# EAGLE board rev1 (EAGLE 8.2.2)
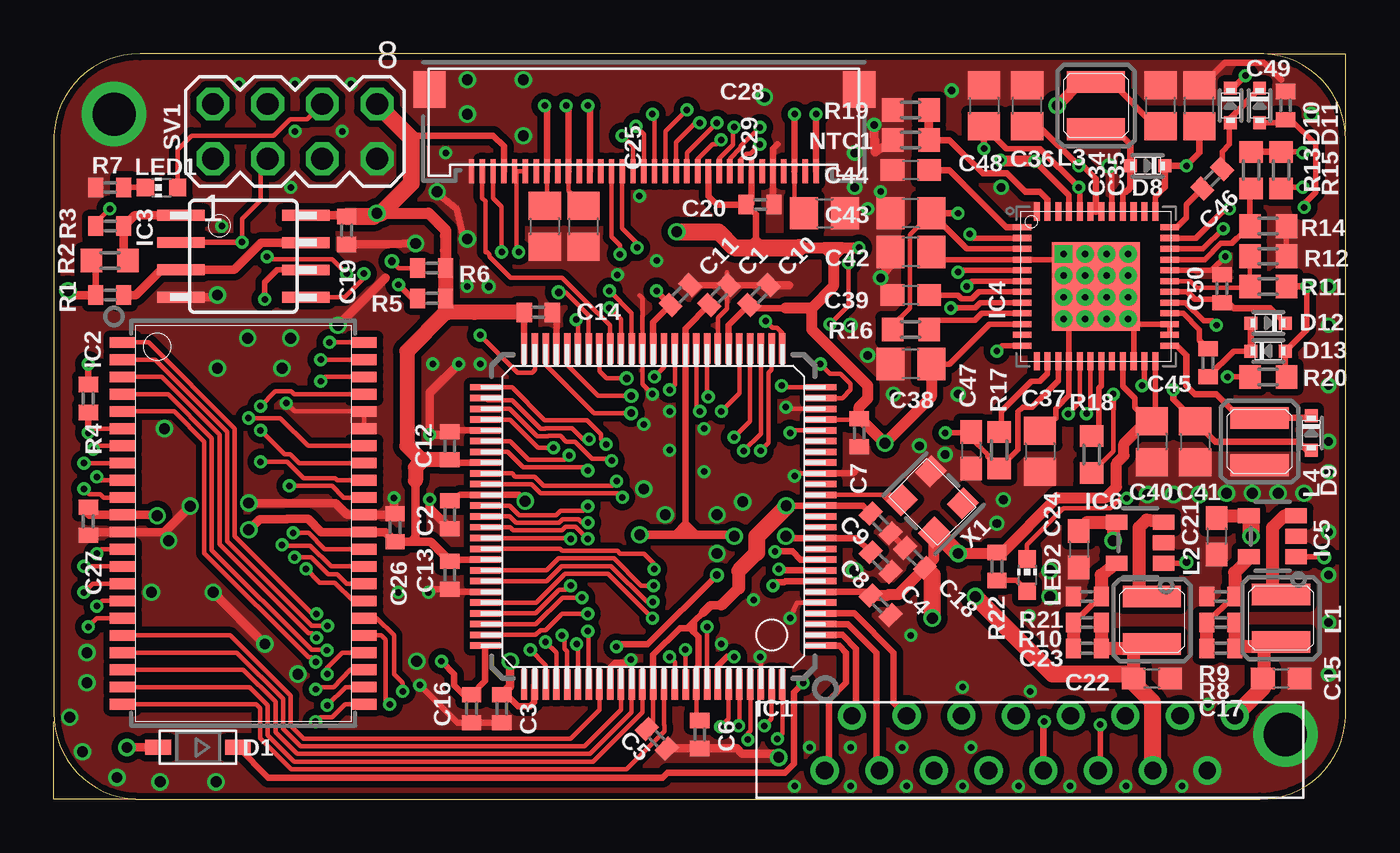
[diagram p3: board, top side]
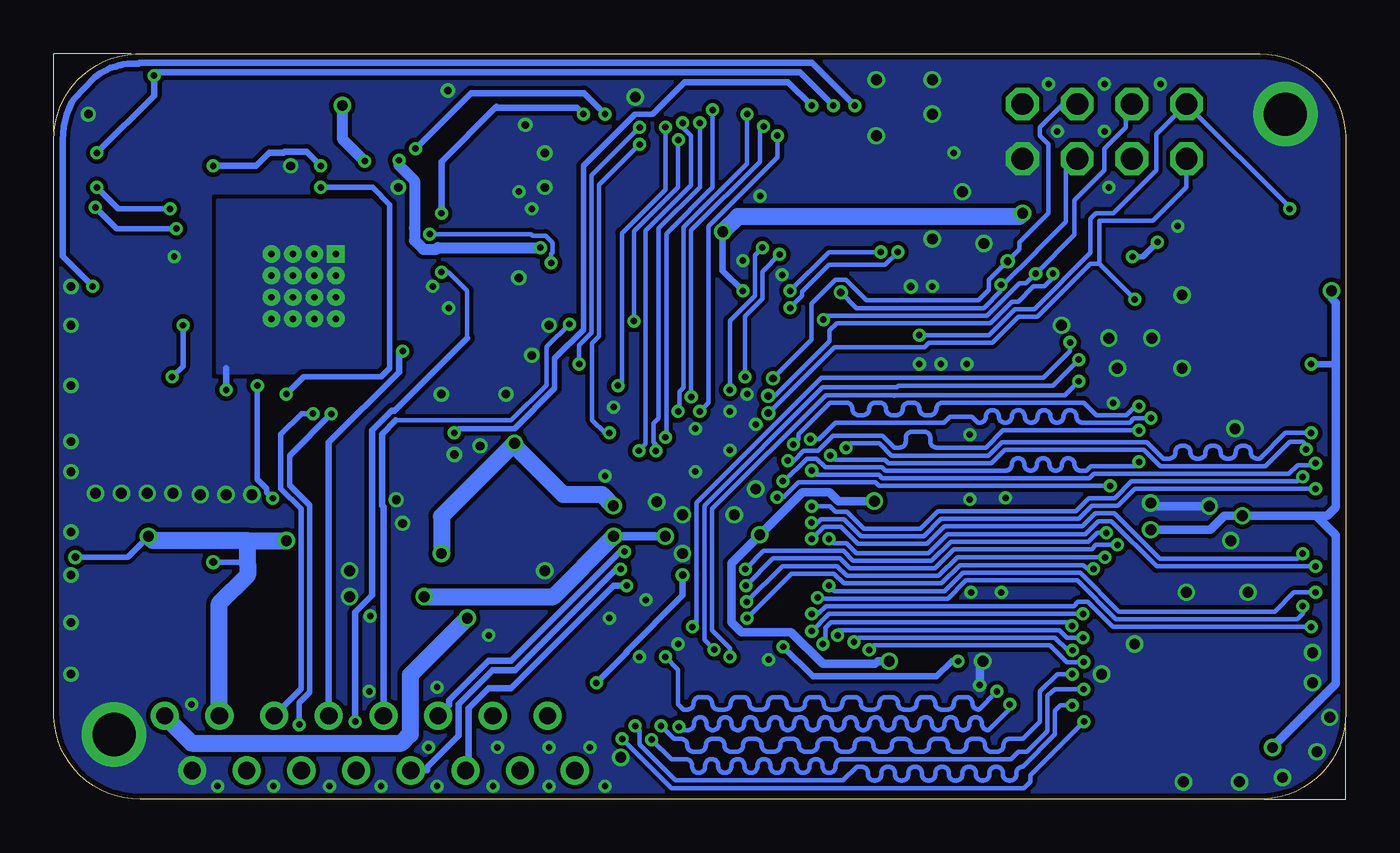
[diagram p4: board, bottom side, seen from below]

Size 60 x 34.6 mm. Coordinates in mm from the lower left corner, seen from the top.
Outline: 3.8,0 56,0 arc88 60,3.8 60,30.6 arc88 56.2,34.6 4,34.6 arc88 0,30.8 0,4 arc88 3.8,0
Outline: 3.8,0 0,0 0,3.6
Outline: 56.4,34.6 60,34.6 60,31
Copper layers (1*16): Top 0.035mm / dielectric 1.5mm / Bottom 0.035mm
Design rules "rules *": minimum track width 6mil, minimum drill 0.3mm, track to track 6mil, track to pad 6mil, pad to pad 6mil, via to via 6mil, smd to smd 0mil, copper to edge 10mil, drill to drill 10mil, minimum pad ring 10mil, minimum via ring 6mil, stop-mask expansion 2mil, vias tented up to drill 100mil, thermal gap 10mil

## Footprints (pad centres in the part's own frame; a part is rotated, then mirrored left to right if it is on the bottom)
C0402 = smd 0.7 x 0.9: 1 -0.65,0; 2 0.65,0
C0603 = smd 1.1 x 1: 1 -0.85,0; 2 0.85,0
C0805 = smd 1.3 x 1.5: 1 -0.95,0; 2 0.95,0
SOD-123 = smd 1.2 x 0.7: A 1.85,0; C -1.85,0
SOD523 = smd 0.6 x 0.6: A 0.8,0; C -0.8,0
VQ100 = smd 1.4 x 0.3: 1 -7.8,6; 2 -7.8,5.5; 3 -7.8,5; 4 -7.8,4.5; 5 -7.8,4; 6 -7.8,3.5; 7 -7.8,3; 8 -7.8,2.5; 9 -7.8,2; 10 -7.8,1.5; 11 -7.8,1; 12 -7.8,0.5; 13 -7.8,0; 14 -7.8,-0.5; 15 -7.8,-1; 16 -7.8,-1.5; 17 -7.8,-2; 18 -7.8,-2.5; 19 -7.8,-3; 20 -7.8,-3.5; 21 -7.8,-4; 22 -7.8,-4.5; 23 -7.8,-5; 24 -7.8,-5.5; 25 -7.8,-6; 51 7.8,-6; 52 7.8,-5.5; 53 7.8,-5; 54 7.8,-4.5; 55 7.8,-4; 56 7.8,-3.5; 57 7.8,-3; 58 7.8,-2.5; 59 7.8,-2; 60 7.8,-1.5; 61 7.8,-1; 62 7.8,-0.5; 63 7.8,0; 64 7.8,0.5; 65 7.8,1; 66 7.8,1.5; 67 7.8,2; 68 7.8,2.5; 69 7.8,3; 70 7.8,3.5; 71 7.8,4; 72 7.8,4.5; 73 7.8,5; 74 7.8,5.5; 75 7.8,6 | smd 0.3 x 1.4: 26 -6,-7.8; 27 -5.5,-7.8; 28 -5,-7.8; 29 -4.5,-7.8; 30 -4,-7.8; 31 -3.5,-7.8; 32 -3,-7.8; 33 -2.5,-7.8; 34 -2,-7.8; 35 -1.5,-7.8; 36 -1,-7.8; 37 -0.5,-7.8; 38 0,-7.8; 39 0.5,-7.8; 40 1,-7.8; 41 1.5,-7.8; 42 2,-7.8; 43 2.5,-7.8; 44 3,-7.8; 45 3.5,-7.8; 46 4,-7.8; 47 4.5,-7.8; 48 5,-7.8; 49 5.5,-7.8; 50 6,-7.8; 76 6,7.8; 77 5.5,7.8; 78 5,7.8; 79 4.5,7.8; 80 4,7.8; 81 3.5,7.8; 82 3,7.8; 83 2.5,7.8; 84 2,7.8; 85 1.5,7.8; 86 1,7.8; 87 0.5,7.8; 88 0,7.8; 89 -0.5,7.8; 90 -1,7.8; 91 -1.5,7.8; 92 -2,7.8; 93 -2.5,7.8; 94 -3,7.8; 95 -3.5,7.8; 96 -4,7.8; 97 -4.5,7.8; 98 -5,7.8; 99 -5.5,7.8; 100 -6,7.8
TSOP-2 = smd 0.5 x 1.2: 1 -8.4,-5.6; 2 -7.6,-5.6; 3 -6.8,-5.6; 4 -6,-5.6; 5 -5.2,-5.6; 6 -4.4,-5.6; 7 -3.6,-5.6; 8 -2.8,-5.6; 9 -2,-5.6; 10 -1.2,-5.6; 11 -0.4,-5.6; 12 0.4,-5.6; 13 1.2,-5.6; 14 2,-5.6; 15 2.8,-5.6; 16 3.6,-5.6; 17 4.4,-5.6; 18 5.2,-5.6; 19 6,-5.6; 20 6.8,-5.6; 21 7.6,-5.6; 22 8.4,-5.6; 23 8.4,5.6; 24 7.6,5.6; 25 6.8,5.6; 26 6,5.6; 27 5.2,5.6; 28 4.4,5.6; 29 3.6,5.6; 30 2.8,5.6; 31 2,5.6; 32 1.2,5.6; 33 0.4,5.6; 34 -0.4,5.6; 35 -1.2,5.6; 36 -2,5.6; 37 -2.8,5.6; 38 -3.6,5.6; 39 -4.4,5.6; 40 -5.2,5.6; 41 -6,5.6; 42 -6.8,5.6; 43 -7.6,5.6; 44 -8.4,5.6
SOP08 = smd 0.5 x 2.2: 1 -1.905,-2.9; 2 -0.645,-2.9; 3 0.625,-2.9; 4 1.895,-2.9; 5 1.905,2.9; 6 0.635,2.9; 7 -0.635,2.9; 8 -1.905,2.9
RGZ = smd 4.1 x 4.1: GN0 0,0 | drill 0.3 pad 0.4: GN1 -1.5,1.5 | drill 0.3 pad 0.406: GN2 -0.5,1.5; GN3 0.5,1.5; GN4 1.5,1.5; GN5 -1.5,0.5; GN6 -0.5,0.5; GN7 0.5,0.5; GN8 1.5,0.5; GN9 -1.5,-0.5; GN10 -0.5,-0.5; GN11 0.5,-0.5; GN12 1.5,-0.5; GN14 -0.5,-1.5; GN15 0.5,-1.5; GN16 1.5,-1.5 | drill 0.3 pad 0.406 square: GN13 -1.5,-1.5 | smd 0.85 x 0.28: P13 3.475,-2.75; P14 3.475,-2.25; P15 3.475,-1.75; P16 3.475,-1.25; P17 3.475,-0.75; P18 3.475,-0.25; P19 3.475,0.25; P20 3.475,0.75; P21 3.475,1.25; P22 3.475,1.75; P23 3.475,2.25; P24 3.475,2.75; P37 -3.475,2.75; P38 -3.475,2.25; P39 -3.475,1.75; P40 -3.475,1.25; P41 -3.475,0.75; P42 -3.475,0.25; P43 -3.475,-0.25; P44 -3.475,-0.75; P45 -3.475,-1.25; P46 -3.475,-1.75; P47 -3.475,-2.25; P48 -3.475,-2.75 | smd 0.28 x 0.85: P25 2.75,3.425; P26 2.25,3.425; P27 1.75,3.425; P28 1.25,3.425; P29 0.75,3.425; P30 0.25,3.425; P31 -0.25,3.425; P32 -0.75,3.425; P33 -1.25,3.425; P34 -1.75,3.425; P35 -2.25,3.425; P36 -2.75,3.425; P$1 -2.75,-3.425; P$2 -2.25,-3.425; P$3 -1.75,-3.425; P$4 -1.25,-3.425; P$5 -0.75,-3.425; P$6 -0.25,-3.425; P$7 0.25,-3.425; P$8 0.75,-3.425; P$9 1.25,-3.425; P$10 1.75,-3.425; P$11 2.25,-3.425; P$12 2.75,-3.425
TSOT25 = smd 0.7 x 1: 1 -0.95,-1.1; 2 0,-1.1; 3 0.95,-1.1; 4 0.95,1.1; 5 -0.95,1.1
XF2M-3315-1A = smd 0.25 x 1.1: 1 -8,3.05; 2 -7.5,3.05; 3 -7,3.05; 4 -6.5,3.05; 5 -6,3.05; 6 -5.5,3.05; 7 -5,3.05; 8 -4.5,3.05; 9 -4,3.05; 10 -3.5,3.05; 11 -3,3.05; 12 -2.5,3.05; 13 -2,3.05; 14 -1.5,3.05; 15 -1,3.05; 16 -0.5,3.05; 17 0,3.05; 18 0.5,3.05; 19 1,3.05; 20 1.5,3.05; 21 2,3.05; 22 2.5,3.05; 23 3,3.05; 24 3.5,3.05; 25 4,3.05; 26 4.5,3.05; 27 5,3.05; 28 5.5,3.05; 29 6,3.05; 30 6.5,3.05; 31 7,3.05; 32 7.5,3.05; 33 8,3.05 | smd 1.5 x 1.7: P$1 -10,-0.75; P$2 9.95,-0.75
TMM-5-L-16-2 = drill 0.8: 1 0,-1.27; 2 1.27,1.27; 3 2.54,-1.27; 4 3.81,1.27; 5 5.08,-1.27; 6 6.35,1.27; 7 7.62,-1.27; 8 8.89,1.27; 9 10.16,-1.27; 10 11.43,1.27; 11 12.7,-1.27; 12 13.97,1.27; 13 15.24,-1.27; 14 16.51,1.27; 15 17.78,-1.27; 16 19.05,1.27
3015 = smd 1 x 2.7: P$1 -1.1,0; P$2 1.1,0
CHIP-LED0603 = smd 0.8 x 0.8: A 0,-0.75; C 0,0.75
R0603 = smd 1 x 1.1: 1 -0.85,0; 2 0.85,0
R0402 = smd 0.7 x 0.9: 1 -0.65,0; 2 0.65,0
MA04-2 = drill 1.016 octagon: 1 -3.81,-1.27; 2 -3.81,1.27; 3 -1.27,-1.27; 4 -1.27,1.27; 5 1.27,-1.27; 6 1.27,1.27; 7 3.81,-1.27; 8 3.81,1.27
3225 = smd 1.1 x 1: 1 -0.95,1.05; 2 -0.95,-1.05; 3 0.95,-1.05; 4 0.95,1.05

## Placement (x,y rotation side)
C1  100nF  [C0402]  30.9,23.4 45 top
C2  100nF  [C0402]  18.4,13.2 270 top
C3  100nF  [C0402]  20.8,4.2 270 top
C4  100nF  [C0402]  38.4,11 315 top
C5  100nF  [C0402]  28,2.8 315 top
C6  100nF  [C0402]  30,3 270 top
C7  100nF  [C0402]  37.4,17 270 top
C8  100nF  [C0402]  38.4,9 315 top
C9  100nF  [C0402]  38.4,12.8 315 top
C10  100nF  [C0402]  32.75,23.4 45 top
C11  100nF  [C0402]  29.1,23.4 45 top
C12  100nF  [C0402]  18.4,16.4 90 top
C13  100nF  [C0402]  18.4,10.4 270 top
C14  100nF  [C0402]  22.5,22.6 0 top
C15  10uF  [C0603]  57,5.6 0 top
C16  [C0402]  19.4,4.2 270 top
C17  100pF  [C0402]  54.2,7 0 top
C18  100nF  [C0402]  40,11.2 135 top
C19  100nF  [C0402]  13.6,26.4 270 top
C20  100nF  [C0402]  32.8,27.6 0 top
C21  10uF  [C0603]  54,12.2 270 top
C22  10uF  [C0603]  51,5.6 0 top
C23  100pF  [C0402]  48,7 0 top
C24  10uF  [C0603]  47.6,11.6 270 top
C25  4u7F  [C0805]  24.6,26.6 270 top
C26  100nF  [C0402]  15.85,12.6 90 top
C27  100nF  [C0402]  1.6,12.9 270 top
C28  4u7F  [C0805]  35.8,27.2 0 top
C29  4u7F  [C0805]  22.8,26.6 270 top
C34  10uF  [C0805]  51.4,32.2 90 top
C35  4u7F  [C0805]  53.2,32.2 90 top
C36  4u7F  [C0805]  45.2,32.2 90 top
C37  4u7F  [C0805]  45.8,16.15 270 top
C38  10uF  [C0805]  39.8,20.2 180 top
C39  4u7F  [C0603]  39.8,23.4 180 top
C40  10uF  [C0805]  51,16.6 270 top
C41  4u7F  [C0805]  53,16.6 270 top
C42  4u7F  [C0805]  39.8,25.4 180 top
C43  4u7F  [C0805]  39.8,27.2 180 top
C44  4u7F  [C0603]  39.8,29.2 180 top
C45  10nF  [C0402]  53.6,20.25 270 top
C46  10nF  [C0402]  53.8,28.8 225 top
C47  4u7F  [C0603]  42.6,16.2 270 top
C48  4u7F  [C0805]  43.2,32.2 270 top
C49  100nF  [C0402]  57.2,32.2 270 top
C50  100nF  [C0402]  54.25,23.7 90 top
D1  [SOD-123]  6.7,2.4 180 top
D8  SKL13-DIO  [SOD523]  50.8,29.4 180 top
D9  SKL13-DIO  [SOD523]  58.4,17 270 top
D10  SKL13-DIO  [SOD523]  56,32.2 270 top
D11  SKL13-DIO  [SOD523]  54.65,32.2 270 top
D12  SKL13-DIO  [SOD523]  56.4,22.1 180 top
D13  SKL13-DIO  [SOD523]  56.4,20.8 0 top
IC1  ICE40-HX1K-VQ100  [VQ100]  27.84,13.12 180 top
IC2  IS61WV256BXX  [TSOP-2]  8.8,12.8 270 top
IC3  25LPWP016D  [SOP08]  8.8,25.2 270 top
IC4  TPS65185  [RGZ]  48.4,23.8 270 top
IC5  PAM2304AABADJ  [TSOT25]  56.6,12.2 90 top
IC6  PAM2304AABADJ  [TSOT25]  50.45,11.9 90 top
J1  XF2M-3315-1A  [XF2M-3315-1A]  27.4,32.2 180 top
J2  TMM-5-L-16-2  [TMM-5-L-16-2]  35.8,2.6 0 top
L1  1uH  [3015]  57,8.4 270 top
L2  1uH  [3015]  51,8.3 270 top
L3  2u2H  [3015]  48.4,32.2 270 top
L4  4u7H  [3015]  56,16.6 270 top
LED1  [CHIP-LED0603]  5,28.4 90 top
LED2  [CHIP-LED0603]  45.2,10.4 0 top
NTC1  10k  [R0603]  39.8,30.6 0 top
R1  10k  [R0402]  2.6,23.4 180 top
R2  10k  [R0603]  2.6,25 0 top
R3  22  [R0402]  2.6,26.6 180 top
R4  10k  [R0402]  1.6,18.6 270 top
R5  10k  [R0402]  17.55,23.25 180 top
R6  2k2  [R0402]  17.55,24.65 180 top
R7  22  [R0402]  2.6,28.4 0 top
R8  540k  [R0402]  54.2,8.2 180 top
R9  120k  [R0402]  54.2,9.4 0 top
R10  540k  [R0402]  48,8.2 180 top
R11  1M  [R0603]  56.4,23.8 0 top
R12  52k3  [R0603]  56.4,25.2 180 top
R13  1M  [R0603]  55.6,29.2 270 top
R14  47k5  [R0603]  56.4,26.6 0 top
R15  [R0603]  57,29.2 90 top
R16  [R0603]  39.8,21.8 180 top
R17  [R0603]  43.9,16.2 270 top
R18  [R0603]  48.2,16 270 top
R19  43k  [R0603]  39.8,32 0 top
R20  [R0603]  56.4,19.6 0 top
R21  120k  [R0402]  48,9.4 0 top
R22  22  [R0402]  43.8,10.8 270 top
SV1  [MA04-2]  11.2,31 0 top
X1  DSC61XX  [3225]  40.8,13.8 225 top

## Tracks (layer width: path | path; a pad name or v marks a point on that pad's centre or on a via)
1V2  (via drill 0.5, 0.5 pad 0.45)
  Top 0.3: C2.1 18.87,14.12 IC1.61 21.6,14.12 v21.89,13.83 | IC1.35 | IC1.35 29.34,21.84 C1.1 | 29.34,12.82 IC1.35 | 29.34,12.82 29.34,12.32 29.39,12.27 | v34,12.2 34.08,12.12 IC1.11 37.28,12.12 C4.1 | 28.8,12.27 28.8,12.28 29.34,12.82 | 30,12.27 29.89,12.27 29.34,12.82
  Top 0.305: IC1.77 22.3,5.28 22.3,4.49 22.12,4.32 21.56,4.32 21.03,4.85 C3.1
  Top 0.4: v21.2,6.4 21.2,5.25 C3.1 | v27.21,12.27 28.8,12.27 29.39,12.27 30,12.27 31.53,12.27 v31.6,12.2
  Top 0.6: R10.1 C23.2 50.11,7 50.15,7.04 | C22.1 50.15,7.04 | 50.15,7.04 50.15,7.35 50.2,7.4 50.9,7.4 L2.P$2
  Top 0.8: C22.1 49.73,5.8 | J2.13 51.04,4.5 49.73,5.8 | v42.8,9.4 46.4,5.8 49.73,5.8
  Bottom 0.4: v21.2,6.4 21.73,6.4 21.86,6.28 24.29,6.28 25.76,7.75 28.07,7.75 28.53,8.21 28.53,10.95 v27.21,12.27 25.23,14.25 23.97,14.25 23.55,13.83 v21.89,13.83 | v34,12.2 v31.6,12.2
  Bottom 0.8: v42.8,9.4 36.8,9.4 v34,12.2
2V5  (via drill 0.3, 0.3 pad 0.45, 0.35)
  Top 0.3: C16.1 19.04,4.85 18.6,5.29 18.6,5.8 v18,6.4 | v34.8,5.4 34.37,4.97 34.37,1.65 33.95,1.23 28.5,1.23 28.26,0.99 9.96,0.99 D1.C | v30.8,10.4 27.58,7.18 26.24,7.18 v26.13,7.07
  Top 0.305: IC1.75 20.04,5.49 C16.1
  Bottom 0.3: v18,6.4 18.3,6.4 19,5.7 24.75,5.7 v26.13,7.07 | v34.8,5.4 33.41,6.79 33.41,6.85 30.8,9.46 v30.8,10.4
3V3  (via drill 0.3, 0.5, 0.5 pad 0.45)
  Top 0.2: IC1.88 27.84,3.56 C5.1 | IC1.92 29.84,3.81 C6.1 | IC1.22 37.27,17.62 C7.1 | C40.1 51.1,17.55 51.15,17.5 | R22.1 43.95,11.45 44,11.4 | R6.1 18.2,24.38
  Top 0.25: IC4.P$10 43.45,22.05 41.6,20.2 C38.1 | IC4.P45 47.15,28.03 v45.56,29.62 | 51.15,17.5 IC4.P24 | IC4.P21 49.65,19.17 50.2,18.62 50.2,18.2 50.85,17.55 C40.1
  Top 0.3: IC1.67 18.47,11.12 C13.1 | IC1.58 18.53,15.62 C12.1 | 29.74,7.75 29.94,7.55 29.94,6.2 29.84,6.1 IC1.92 | 29.74,7.75 29.74,8.25 | IC1.88 27.84,6.7 29.07,7.93 29.41,7.93 | IC1.50 C14.1 | IC1.38 | IC1.31 | IC1.38 27.84,22.14 C11.1 28,23.58 v28,23.6 | IC1.31 31.34,21.99 C10.1 32.43,22.8 34,22.8 | 29.41,7.93 29.56,7.93 29.74,7.75 | 29.74,8.25 29.73,8.25 29.41,7.93 | 33.03,25.6 32.6,26.03 | 32.2,25.6 32.2,25.62 32.6,26.03 | C9.1 37.58,13.62 IC1.14 v34.02,13.62 34,13.6 | IC1.6 37.78,9.62 C8.1 | 30.14,8.65 29.74,8.25 | R1.2 1.95,24.8 R2.1 | R4.1 v1.6,20.2 | C34.1 51.15,31.25 49.2,33.2 48.5,33.2 L3.P$1 | J1.7 32.4,27.65 C20.1 | C20.1 30.8,27.6 30.4,28 J1.11 | 32.6,26.03 32.6,27.14 C20.1 | J1.30 20.9,30.3 20.4,30.8 16.72,30.8 16.6,30.68
  Top 0.4: v9.05,12.5 9.55,13 10.84,13 10.85,13.01 11.81,13.01 12.42,12.4 IC2.33 15.4,12.4 C26.1 16.6,11.95 | C27.1 1.65,13.2 IC2.11 4.75,13.2 v4.8,13.15 | 16.6,11.95 17.5,11.95 C13.1 | 16.6,11.95 16.8,12.15 16.8,14.8 | v3.4,2.4 D1.A | IC3.8 13.54,27.11 C19.1 14.05,27.05 | R1.2 0.86,23.4 v0.66,23.6 | 31,9 30.49,9 30.14,8.65
  Top 0.5: C11.1 28.64,22.96 | 36.59,25.6 35.81,25.6 | 35.81,25.6 34.62,25.6 33.03,25.6 32.2,25.6 | 36.59,25.6 v37.4,25.6 | C10.1 32.46,22.94 | 36.2,25.2 36.59,25.6 | 36.2,25.2 36.2,25.21 35.81,25.6 | L3.P$1 47.7,33.3 v46.6,32.2 | v45.56,29.62 44.01,29.62 v43.97,29.66 | C38.1 40.75,18.67 v38.6,16.52 37.47,17.65 C7.1 37.4,18.2 37.8,18.6 37.8,19.2 35.2,21.8 35.2,22.8 | C8.1 38.72,9.46 38.76,9.51 39.23,9.51 C18.1 40.87,11.15 X1.4 | C40.1 50.65,17.2 50.4,17.2 49.7,16.5 49.7,15.94 49.35,15.59 49.35,14.48 48.87,14 46.6,14 44,11.4 v42,11.4 | 31.8,9.8 31,9 | 35.2,22.8 36.2,23.8 36.2,25.2 | 35.2,22.8 34,22.8 | v15,27.2 17.4,27.2 18.2,26.4 18.2,26.14 18.2,26.13 18.2,25.47 18.2,25.46 R6.1
  Top 0.6: R8.1 C17.2 54.95,7.1 56.2,7.1 | C15.1 56.2,5.65 56.2,7.1 | 56.2,7.1 56.2,7.4 | 31.8,10.6 31.8,9.8
  Top 0.7: C12.1 17.15,15.75 | 17.15,15.75 16.8,15.4 16.8,14.8 | 17.15,15.75 17.05,15.75 16.4,16.4 16.4,20.8 18.2,22.6 18.2,22.7 | 18.2,22.7 R5.1 R6.1 | C14.1 19.54,22.6 19.53,22.59 18.3,22.59 18.2,22.7 | 32.64,11.44 31.8,10.6
  Top 0.8: 56.15,7.35 56.2,7.4 56.9,7.4 L1.P$2 | C15.1 56.15,5.17 J2.16 | v40.8,8.4 40.8,10.4 C18.1 | X1.4 41.01,12.39 v42,11.4 | v34.02,13.62 34.02,13.57 32.64,12.19 32.64,11.44 | C19.1 14.85,27.05 v15,27.2 15.2,27.2 16.6,28.6 16.6,30.68 SV1.8 | v28.94,26.34 30.86,26.34 31.6,25.6 34.62,25.6
  Bottom 0.3: v1.6,20.2 v1.59,20.19 0.45,20.19 | v28.94,26.34 28.94,24.54 v28,23.6
  Bottom 0.4: v9.05,12.5 6.3,12.5 5.64,13.15 v4.8,13.15 1.35,13.15 | 1.35,13.15 0.45,12.25 0.45,5.35 v3.4,2.4 | 1.35,13.15 0.84,13.15 0.45,13.55 0.45,20.19 0.45,23.05 0.66,23.26 v0.66,23.6
  Bottom 0.5: v46.6,32.2 46.6,30.66 v45.56,29.62 | v43.97,29.66 43.97,29.44 43.24,28.71 43.24,26.52 43.25,26.52 43.25,25.94 42.83,25.52 42.25,25.52 42.17,25.6 v37.4,25.6 | 38.6,16.4 v38.6,16.52
  Bottom 0.8: J2.16 54.85,3.85 53.6,2.6 43.85,2.6 43.45,3 43.45,5.75 v40.8,8.4 | v42,11.4 42,13.12 v38.6,16.52 | v15,27.2 15.15,27.05 28.23,27.05 v28.94,26.34 | 38.6,16.4 36.34,14.14 34.55,14.14 v34.02,13.62
!CE  (via drill 0.3 pad 0.45)
  Top 0.2: IC2.6 1.8,17.2 v1.6,17 | IC1.54 21.18,17.62 22.49,16.31 v23.2,16.31
  Top 0.3: v1.6,17 R4.2
  Bottom 0.2: v1.6,17 2.8,17 3.99,15.81 4.12,15.81 arc90 4.41,16.1 4.41,16.11 arc-90 4.7,16.4 4.82,16.4 arc-90 5.11,16.11 5.11,16.1 arc90 5.4,15.81 5.52,15.81 arc90 5.81,16.1 5.81,16.11 arc-90 6.1,16.4 6.22,16.4 arc-90 6.51,16.11 6.51,16.1 arc90 6.8,15.81 6.92,15.81 arc90 7.21,16.1 7.21,16.11 arc-90 7.5,16.4 7.62,16.4 arc-90 7.91,16.11 7.91,16.1 arc90 8.2,15.81 8.47,15.81 9.22,16.57 15.97,16.57 16.59,15.95 21.09,15.95 21.65,16.52 23,16.52 v23.2,16.31
!OE  (via drill 0.3 pad 0.45)
  Top 0.2: IC1.51 21.28,19.12 22.8,17.6 24.77,17.6 25.42,16.95 25.42,16.7 v25.65,16.47 | IC2.41 11.17,18.8 11.03,18.94 10.29,18.94 v9.6,18.25
  Bottom 0.2: v9.6,18.25 9.76,18.25 10.18,17.83 11.57,17.83 12.15,18.41 18.72,18.41 arc-90 19.02,18.12 arc90 19.3,17.83 19.5,17.83 arc90 19.79,18.12 arc-90 20.08,18.41 20.28,18.41 arc-90 20.57,18.12 arc90 20.86,17.83 21.06,17.83 arc90 21.35,18.12 arc-90 21.64,18.41 21.84,18.41 arc-90 22.13,18.12 arc90 22.42,17.83 22.62,17.83 arc90 22.91,18.12 arc-90 23.2,18.41 23.96,18.41 25.42,16.95 25.42,16.7 v25.65,16.47
!WE  (via drill 0.3 pad 0.45)
  Top 0.2: IC2.17 2,8.4 v1.6,8 | v24.8,8.6 23.6,8.6 22.85,7.85 22.61,7.85 22.38,7.62 IC1.74
  Bottom 0.2: v24.8,8.6 24.5,8.6 24.15,8.95 12.63,8.95 12.43,9.15 11.97,9.15 10.81,8 v1.6,8
A00  (via drill 0.3 pad 0.45)
  Top 0.2: IC2.1 4.4,21.2 8.4,17.2 8.4,12.2 12,8.6 v12.2,8.6 | IC1.82 24.84,7.76 v24.8,7.8
  Bottom 0.2: v12.2,8.6 24,8.6 v24.8,7.8
A01  (via drill 0.3 pad 0.45)
  Top 0.2: IC2.2 4.7,20.4 8.05,17.05 8.05,11.97 11.97,8.04 v12.72,8.04 | IC1.81 24.34,7.14 v24.29,7.2
  Bottom 0.2: v12.72,8.04 12.87,8.2 23.9,8.2 24.15,7.95 24.15,7.33 v24.29,7.2
A02  (via drill 0.3 pad 0.45)
  Top 0.2: IC2.3 5,19.6 7.7,16.91 7.7,11.82 11.82,7.69 12,7.69 v12.2,7.49 | IC1.80 23.84,6.86 23.73,6.97 23.73,7.47 v23.6,7.6
  Bottom 0.2: v12.2,7.49 12.95,7.49 13.3,7.85 23.55,7.85 23.6,7.8 v23.6,7.6
A03  (via drill 0.3 pad 0.45)
  Top 0.2: IC2.4 5.3,18.8 7.34,16.76 7.34,11.56 11.97,6.94 12.66,6.94 v12.69,6.91 | IC1.79 23.34,6.79 v22.84,7.29
  Bottom 0.2: v12.69,6.91 12.91,6.91 13.49,7.5 22.64,7.5 v22.84,7.29
A04  (via drill 0.3 pad 0.45)
  Top 0.2: IC2.5 5.59,18 6.99,16.6 6.99,11.42 11.82,6.58 11.95,6.58 v12.16,6.37 | IC1.78 22.84,6.22 v22.13,6.93
  Bottom 0.2: v12.16,6.37 12.45,6.37 12.46,6.36 12.96,6.36 13.74,7.14 21.92,7.14 v22.13,6.93
A05
  Top 0.2: IC2.18 8.2,7.6 11,4.8 11,3.4 11.6,2.8 24,2.8 25.34,4.14 IC1.83
A06
  Top 0.2: IC2.19 8.5,6.8 10.65,4.65 10.65,3.25 11.45,2.45 24.65,2.45 26.34,4.14 IC1.85
A07
  Top 0.2: IC2.20 8.8,6 10.29,4.51 10.29,3.11 11.31,2.1 24.89,2.1 26.84,4.04 IC1.86
A08
  Top 0.2: IC2.21 9.11,5.2 9.94,4.36 9.94,2.96 11.16,1.74 25.04,1.74 27.34,4.04 IC1.87
A09
  Top 0.2: IC2.22 9.41,4.4 9.59,4.22 9.59,2.82 11.02,1.39 26.59,1.39 28.36,3.16 28.36,3.44 28.34,3.45 IC1.89
A10  (via drill 0.3 pad 0.45)
  Top 0.2: IC2.23 13.54,4.4 12.93,3.79 12.39,3.79 v12.15,3.6 | IC1.100 33.84,3.04 v33.6,2.8
  Bottom 0.2: v12.15,3.6 14.65,1.1 14.65,0.8 14.94,0.51 16.69,0.51 | 16.69,0.51 | 16.69,0.51 31.31,0.51 v33.6,2.8
A11  (via drill 0.3 pad 0.45)
  Top 0.2: IC2.24 13.55,5.2 v12.7,4.35 | IC1.99 33.34,3.74 v33,3.4
  Bottom 0.2: v12.7,4.35 13.25,4.35 13.49,4.11 13.49,3.01 15,1.5 arc-90 15.29,1.21 15.29,1.15 arc90 15.58,0.86 15.63,0.86 arc90 15.92,1.15 15.92,1.21 arc-90 16.21,1.5 16.26,1.5 arc-90 16.55,1.21 16.55,1.15 arc90 16.84,0.86 16.88,0.86 arc90 17.17,1.15 17.17,1.21 arc-90 17.46,1.5 17.51,1.5 arc-90 17.8,1.21 17.8,1.15 arc90 18.09,0.86 18.14,0.86 arc90 18.43,1.15 18.43,1.21 arc-90 18.72,1.5 18.77,1.5 arc-90 19.05,1.21 19.05,1.15 arc90 19.35,0.86 19.39,0.86 arc90 19.68,1.15 19.68,1.21 arc-90 19.97,1.5 20.02,1.5 arc-90 20.31,1.21 20.31,1.15 arc90 20.6,0.86 20.65,0.86 arc90 20.94,1.15 20.94,1.21 arc-90 21.23,1.5 21.27,1.5 arc-90 21.56,1.21 21.56,1.15 arc90 21.85,0.86 21.9,0.86 arc90 22.19,1.15 22.19,1.21 arc-90 22.48,1.5 22.71,1.5 23.34,0.87 31.12,0.87 32.79,2.54 32.79,3.19 v33,3.4
A12  (via drill 0.3 pad 0.45)
  Top 0.2: IC2.25 13.76,6 13,5.2 12.44,5.2 12.29,5.2 v12.16,5.1 | v32.23,2.77 32.23,3.05 32.35,3.17 32.35,5.11 32.34,5.12 IC1.97
  Bottom 0.2: v12.16,5.1 13.5,5.1 13.85,4.8 13.85,3.15 14.8,2.2 15.19,2.2 15.54,1.85 23.4,1.85 arc-90 23.69,1.56 23.69,1.51 arc90 23.98,1.22 24.01,1.22 arc90 24.3,1.51 24.3,1.56 arc-90 24.59,1.85 24.61,1.85 arc-90 24.9,1.56 24.9,1.51 arc90 25.19,1.22 25.22,1.22 arc90 25.51,1.51 25.51,1.56 arc-90 25.8,1.85 25.82,1.85 arc-90 26.11,1.56 26.11,1.51 arc90 26.4,1.22 26.43,1.22 arc90 26.72,1.51 26.72,1.56 arc-90 27.01,1.85 27.03,1.85 arc-90 27.32,1.56 27.32,1.51 arc90 27.61,1.22 27.64,1.22 arc90 27.93,1.51 27.93,1.56 arc-90 28.22,1.85 28.25,1.85 arc-90 28.54,1.56 28.54,1.51 arc90 28.83,1.22 28.85,1.22 arc90 29.14,1.51 29.14,1.56 arc-90 29.43,1.85 29.46,1.85 arc-90 29.75,1.56 29.75,1.51 arc90 30.04,1.22 30.06,1.22 arc90 30.35,1.51 30.35,1.56 arc-90 30.64,1.85 31.32,1.85 v32.23,2.77
A13  (via drill 0.3 pad 0.45)
  Top 0.2: IC2.26 13.4,6.8 12.67,6.07 v12.7,5.8 | IC1.96 31.84,3.44 v31.8,3.4
  Bottom 0.2: v31.8,3.4 31.2,2.8 30.87,2.8 arc90 30.58,2.51 30.58,2.49 arc-90 30.29,2.2 30.01,2.2 arc-90 29.72,2.49 29.72,2.51 arc90 29.43,2.8 29.14,2.8 arc90 28.85,2.51 28.85,2.49 arc-90 28.56,2.2 28.28,2.2 arc-90 27.99,2.49 27.99,2.51 arc90 27.7,2.8 27.42,2.8 arc90 27.12,2.51 27.12,2.49 arc-90 26.84,2.2 26.55,2.2 arc-90 26.26,2.49 26.26,2.51 arc90 25.97,2.8 25.69,2.8 arc90 25.4,2.51 25.4,2.49 arc-90 25.11,2.2 24.82,2.2 arc-90 24.53,2.49 24.53,2.51 arc90 24.24,2.8 23.96,2.8 arc90 23.67,2.51 23.67,2.49 arc-90 23.38,2.2 23.09,2.2 arc-90 22.8,2.49 22.8,2.51 arc90 22.51,2.8 22.23,2.8 arc90 21.94,2.51 21.94,2.49 arc-90 21.65,2.2 21.37,2.2 arc-90 21.08,2.49 21.08,2.51 arc90 20.79,2.8 20.5,2.8 arc90 20.21,2.51 20.21,2.49 arc-90 19.92,2.2 19.64,2.2 arc-90 19.35,2.49 19.35,2.51 arc90 19.06,2.8 18.77,2.8 arc90 18.48,2.51 18.48,2.49 arc-90 18.19,2.2 17.91,2.2 arc-90 17.62,2.49 17.62,2.51 arc90 17.33,2.8 17.05,2.8 arc90 16.75,2.51 16.75,2.49 arc-90 16.46,2.2 16.18,2.2 arc-90 15.89,2.49 15.89,2.51 arc90 15.6,2.8 15,2.8 14.2,3.6 14.2,5 13.4,5.8 12.67,5.8 v12.7,5.8
A14  (via drill 0.3 pad 0.45)
  Top 0.2: 15,7.6 IC2.27 15.2,7.6 15.4,7.4 15.4,4.6 v15.6,4.4 | IC1.95 31.34,3.73 v30.97,3.35
  Bottom 0.2: v15.6,4.4 15.6,4.2 16.6,3.2 arc90 16.89,3.49 16.89,3.51 arc-90 17.18,3.8 17.18,3.8 arc-90 17.47,3.51 17.47,3.49 arc90 17.76,3.2 | 29.4,3.2 arc90 29.69,3.49 29.69,3.51 arc-90 29.98,3.8 29.98,3.8 arc-90 30.27,3.51 30.27,3.49 arc90 30.56,3.2 30.82,3.2 v30.97,3.35 | 29.4,3.2 | 29.4,3.2 arc-90 29.11,3.49 29.11,3.51 arc90 28.82,3.8 28.82,3.8 arc90 28.52,3.51 28.52,3.49 arc-90 28.23,3.2 28.23,3.2 arc-90 27.94,3.49 27.94,3.51 arc90 27.65,3.8 | 27.65,3.8 | 27.65,3.8 arc90 27.36,3.51 27.36,3.49 arc-90 27.07,3.2 27.07,3.2 arc-90 26.78,3.49 26.78,3.51 arc90 26.49,3.8 26.49,3.8 arc90 26.2,3.51 26.2,3.49 arc-90 25.91,3.2 25.91,3.2 arc-90 25.62,3.49 25.62,3.51 arc90 25.32,3.8 | 25.32,3.8 | 25.32,3.8 arc90 25.03,3.51 25.03,3.49 arc-90 24.74,3.2 24.74,3.2 arc-90 24.45,3.49 24.45,3.51 arc90 24.16,3.8 24.16,3.8 arc90 23.87,3.51 23.87,3.49 arc-90 23.58,3.2 | 23.58,3.2 | 23.58,3.2 arc-90 23.29,3.49 23.29,3.51 arc90 23,3.8 23,3.8 arc90 22.71,3.51 22.71,3.49 arc-90 22.42,3.2 22.42,3.2 arc-90 22.13,3.49 22.13,3.51 arc90 21.84,3.8 | 21.84,3.8 | 21.84,3.8 arc90 21.54,3.51 21.54,3.49 arc-90 21.25,3.2 21.25,3.2 arc-90 20.96,3.49 20.96,3.51 arc90 20.67,3.8 20.67,3.8 arc90 20.38,3.51 20.38,3.49 arc-90 20.09,3.2 20.09,3.2 arc-90 19.8,3.49 19.8,3.51 arc90 19.51,3.8 | 19.51,3.8 | 19.51,3.8 arc90 19.22,3.51 19.22,3.49 arc-90 18.93,3.2 18.93,3.2 arc-90 18.64,3.49 18.64,3.51 arc90 18.34,3.8 18.34,3.8 arc90 18.05,3.51 18.05,3.49 arc-90 17.76,3.2 | 17.76,3.2
A15  (via drill 0.3 pad 0.45)
  Top 0.2: IC2.42 12.6,19.6 v12.4,19.4 | v28.6,6.6 28.84,6.36 IC1.90
  Bottom 0.2: v12.4,19.4 13.04,18.76 20.93,18.76 20.96,18.72 21,18.76 24.15,18.76 29.44,13.47 29.44,7.83 28.6,6.99 v28.6,6.6
A16  (via drill 0.3 pad 0.45)
  Top 0.2: IC2.43 v12.4,20.4 | v29.33,6.94 IC1.91
  Bottom 0.2: v12.4,20.4 13.6,19.2 20.77,19.2 20.85,19.11 21.14,19.11 24.29,19.11 29.79,13.62 29.79,7.4 v29.33,6.94
A17  (via drill 0.3 pad 0.45)
  Top 0.2: IC2.44 v12.8,21.2 | v30.34,8 IC1.93
  Bottom 0.2: v12.8,21.2 12.8,20.8 14.05,19.55 20.62,19.55 | 20.62,19.55 | 20.62,19.55 24.35,19.55 30.14,13.76 30.14,8.2 v30.34,8
A18  (via drill 0.3 pad 0.45)
  Top 0.2: IC2.28 15,8.4 15.8,7.6 15.8,5.8 16.2,5.4 v16.2,5
  Top 0.3: v31.6,6.6 31.25,6.6 30.84,6.18 IC1.94
  Bottom 0.2: v16.2,5 17.05,4.16 arc90 17.34,4.45 17.34,4.45 arc-90 17.63,4.74 17.91,4.74 arc-90 18.2,4.45 18.2,4.45 arc90 18.49,4.16 18.77,4.16 arc90 19.06,4.45 19.06,4.45 arc-90 19.35,4.74 19.64,4.74 arc-90 19.93,4.45 19.93,4.45 arc90 20.22,4.16 20.5,4.16 arc90 20.79,4.45 20.79,4.45 arc-90 21.08,4.74 21.36,4.74 arc-90 21.65,4.45 21.65,4.45 arc90 21.94,4.16 22.23,4.16 arc90 22.52,4.45 22.52,4.45 arc-90 22.81,4.74 23.09,4.74 arc-90 23.38,4.45 23.38,4.45 arc90 23.67,4.16 23.95,4.16 arc90 24.24,4.45 24.24,4.45 arc-90 24.53,4.74 24.82,4.74 arc-90 25.11,4.45 25.11,4.45 arc90 25.4,4.16 25.68,4.16 arc90 25.97,4.45 25.97,4.45 arc-90 26.26,4.74 26.54,4.74 arc-90 26.83,4.45 26.83,4.45 arc90 27.12,4.16 27.41,4.16 arc90 27.7,4.45 27.7,4.45 arc-90 27.99,4.74 28.27,4.74 arc-90 28.56,4.45 28.56,4.45 arc90 28.85,4.16 29.13,4.16 arc90 29.42,4.45 29.42,4.45 arc-90 29.71,4.74 30,4.74 arc-90 30.29,4.45 30.29,4.45 arc90 30.58,4.16 30.75,4.16 31,4.4 31,6 v31.6,6.6
CLK_SRC
  Top 0.2: IC1.15 38.4,14.12 38.48,14.12 | 38.48,14.12 38.8,13.8 38.8,14.12 | 38.48,14.12 38.8,14.12 | 38.8,14.12 39.14,14.12 X1.3
CONF_DONE  (via drill 0.35)
  Top 0.2: LED1.A 5.75,30.15 6.4,30.8 10.21,30.8 10.97,31.55 11.76,31.55 SV1.6 | v26.6,19.53 25.67,19.53 25.34,19.86 IC1.43 | R6.2 16.02,24.65 v15.7,24.97
  Bottom 0.2: SV1.6 12.6,32.4 13,32.4 14.2,31.2 14.2,30.8 13.8,30.4 13.8,27.2 15.14,25.86 15.14,25.53 v15.7,24.97 16.56,24.11 16.56,23.64 17.05,23.15 22.25,23.15 23.21,24.11 23.69,24.11 24.81,22.99 24.81,21.32 v26.6,19.53
CONF_RESET  (via drill 0.3, 0.35)
  Top 0.2: v23.45,23.53 23.77,23.53 24.84,22.46 IC1.44
  Top 0.3: R5.2 16.64,23.25 v16.01,23.88
  Bottom 0.2: 16.01,23.78 v16.01,23.88 | 16.01,23.78 16.01,23.59 16.8,22.8 22.72,22.8 v23.45,23.53 | 16.01,23.78 14.35,25.44 14.35,25.45 13,26.8 13,29.2 SV1.5
CONF_SCK  (via drill 0.3, 0.35)
  Top 0.2: IC1.48 22.84,20.16 24.73,18.27 | 24.73,18.27 24.84,18.16 | v26.81,17.91 25.09,17.91 24.73,18.27
  Top 0.25: v9.8,23.2 9.8,24 10.37,24.57 IC3.6
  Bottom 0.2: 11.45,24.85 11.45,26.85 8.95,26.85 7.4,28.4 SV1.1 | 11.45,24.85 v9.8,23.2 | 11.45,24.85 11.87,24.85 14.32,22.4 15.21,22.4 16.42,21.19 19.37,21.19 19.57,20.99 23.74,20.99 v26.81,17.91
CONF_SDI  (via drill 0.3, 0.35)
  Top 0.2: IC1.46 23.84,20.16 25.28,18.72 v26.82,18.72 | v9.91,25.18 10.02,25.07 12.93,25.07 v13.6,24.4 | 5.92,25.86 IC3.2 | v8.74,25.86 8.74,26.94 9.6,27.8 9.6,29.4 SV1.3
  Top 0.25: 5.92,25.86 v8.74,25.86
  Bottom 0.2: v13.6,24.4 13.6,24.2 14,23.8 14.5,23.8 15.2,23.1 15.5,23.1 16.51,22.09 23.64,22.09 23.96,21.77 23.96,21.26 26.5,18.72 v26.82,18.72
  Bottom 0.25: v9.91,25.18 9.42,25.18 v8.74,25.86
CONF_SDO  (via drill 0.3)
  Top 0.2: v14.4,24.4 14.4,24.2 13.49,23.3 IC3.5 | IC1.45 24.34,22.18 v24.26,22.26
  Bottom 0.2: SV1.4 10.2,32 10.2,31.2 11.2,30.2 11.2,29.2 12.6,27.8 12.6,26.2 v14.4,24.4 14.85,23.95 15.15,23.95 16.65,22.45 24.07,22.45 v24.26,22.26
CONF_SS  (via drill 0.3)
  Top 0.2: IC1.49 22.34,19.94 22.2,19.8 21.54,19.8 v19.8,21.54 | R3.2 1.95,26.75 v2.6,27.4
  Bottom 0.2: v19.8,21.54 16.56,21.54 15.36,22.75 14.47,22.75 11.85,25.37 11.85,26.95 11.6,27.2 10.8,27.2 8.8,29.2 8.8,30.86 SV1.2 2.6,27.48 v2.6,27.4
CTRL_PIN  (via drill 0.3)
  Top 0.25: IC4.P$12 44.05,21.05 v43.8,20.8
  Bottom 0.3: J2.10 47.23,16.56 43.97,19.82 43.97,20.63 v43.8,20.8
D00  (via drill 0.3, 0.3 pad 0.45)
  Top 0.2: IC1.56 21.18,16.62 22.05,15.75 23.73,15.75 v23.94,15.96 | IC2.7 2,16.4 v1.83,16.23
  Bottom 0.2: v23.94,15.96 23.91,15.96 23.7,15.76 21.39,15.76 21.24,15.6 16.44,15.6 15.83,16.21 9.37,16.21 8.61,15.46 3.74,15.46 2.6,16.6 2,16.6 1.83,16.43 v1.83,16.23
D01  (via drill 0.3 pad 0.45)
  Top 0.2: IC2.8 v1.4,15.6 | v24.8,15.26 24.66,15.4 21.8,15.4 21.08,16.12 IC1.57
  Bottom 0.2: v1.4,15.6 1.49,15.51 2.23,15.51 2.63,15.11 11.7,15.11 11.91,14.89 21.53,14.89 21.69,15.05 21.98,15.05 | 21.98,15.05 | v24.8,15.26 24.6,15.05 21.98,15.05
D02  (via drill 0.3 pad 0.45)
  Top 0.2: IC2.9 2.15,14.8 v2,14.96 | IC1.62 21.18,13.62 21.62,13.18 23.32,13.18 23.53,13.39 24.6,13.39 v24.8,13.59
  Bottom 0.2: v2,14.96 2.04,14.96 2.25,14.75 9.95,14.75 10.73,13.97 11.93,13.97 12.54,13.36 18.94,13.36 19.74,12.55 22.37,12.55 23.15,13.34 23.7,13.34 23.95,13.59 v24.8,13.59
D03  (via drill 0.3 pad 0.45)
  Top 0.2: v24.81,12.84 24.53,12.84 24.38,12.99 23.62,12.99 23.46,12.82 21.47,12.82 21.18,13.12 IC1.63 | 1.6,14.2 v1.4,14.4 1.65,14.15 2.15,14.15 2.31,14 IC2.10
  Bottom 0.2: v1.4,14.4 9.8,14.4 10.59,13.61 11.79,13.61 12.39,13.01 18.79,13.01 19.6,12.2 22.52,12.2 23.3,12.99 24.38,12.99 24.53,12.84 v24.81,12.84
D04  (via drill 0.3 pad 0.45)
  Top 0.2: IC2.13 2.2,11.6 v2,11.4 | v24.8,12.08 24.79,12.08 24.23,12.63 23.77,12.63 23.61,12.47 21.33,12.47 21.18,12.62 IC1.64
  Bottom 0.2: v2,11.4 2.25,11.15 8.63,11.15 10.74,13.26 11.63,13.26 12.24,12.66 18.64,12.66 19.45,11.85 22.66,11.85 23.45,12.63 24.23,12.63 24.79,12.08 v24.8,12.08
D05  (via drill 0.3 pad 0.45)
  Top 0.2: IC2.14 v1.4,10.8 | IC1.65 23.96,12.12 v24,12.08
  Bottom 0.2: v1.4,10.8 8.78,10.8 10.89,12.91 11.49,12.91 12.09,12.3 18.5,12.3 19.38,11.42 22.73,11.42 23.19,11.88 23.8,11.88 v24,12.08
D06  (via drill 0.3 pad 0.45)
  Top 0.2: IC2.15 1.8,10 v1.4,9.6 | v24,9.91 23.8,9.71 23.47,9.71 22.39,8.62 IC1.72
  Bottom 0.2: v1.4,9.6 2.4,9.6 3.29,8.71 10.52,8.71 12.33,10.51 17.78,10.51 18.63,9.66 23.75,9.66 v24,9.91
D07  (via drill 0.3 pad 0.45)
  Top 0.2: IC1.73 22.38,8.12 23.62,9.36 v24.53,9.36 | IC2.16 2.25,9.2 v2,8.96
  Bottom 0.2: v2,8.96 2,8.6 2.25,8.35 10.67,8.35 12.47,10.15 17.63,10.15 18.48,9.3 24.47,9.3 v24.53,9.36
D08  (via drill 0.3 pad 0.45)
  Top 0.2: IC1.71 22.39,9.12 23.73,10.47 25.73,10.47 v27.8,8.4 | IC2.29 13.9,9.2 13.05,10.05 12.35,10.05 v11.72,10.68
  Bottom 0.2: v11.72,10.68 12,10.68 12.18,10.86 17.92,10.86 18.77,10.01 23.31,10.01 23.77,10.47 25.73,10.47 v27.8,8.4
D09  (via drill 0.3 pad 0.45)
  Top 0.2: v11.18,11.22 11.47,11.22 11.49,11.24 11.95,11.24 12.74,10.45 13.15,10.45 13.6,10 IC2.30 | IC1.69 22.89,10.12 23.59,10.82 25.88,10.82 27.54,9.16 v27.83,9.16
  Bottom 0.2: v11.18,11.22 11.47,11.22 11.49,11.24 18.04,11.24 18.92,10.36 23.17,10.36 23.62,10.82 26.16,10.82 v27.83,9.16
D10  (via drill 0.3 pad 0.45)
  Top 0.2: IC2.31 12.88,10.8 11.91,11.77 10.63,11.77 v10.6,11.8 | v27.86,9.91 27.28,9.91 26.02,11.17 23.44,11.17 22.89,10.62 IC1.68
  Bottom 0.2: v10.6,11.8 11.6,11.8 11.8,11.6 18.2,11.6 19.09,10.71 23.02,10.71 23.48,11.17 26.6,11.17 v27.86,9.91
D11  (via drill 0.3 pad 0.45)
  Top 0.2: IC2.32 12.58,11.6 11.83,12.36 v11.12,12.36 | v27.88,10.68 27.88,10.92 27.4,11.4 26.3,11.4 26.17,11.52 23.6,11.52 23.5,11.62 IC1.66
  Bottom 0.2: v27.88,10.68 27.03,11.52 23.33,11.52 22.88,11.07 19.23,11.07 18.35,11.95 11.95,11.95 11.54,12.36 v11.12,12.36
D12  (via drill 0.3 pad 0.45)
  Top 0.2: IC2.35 13.46,14 12.92,14.54 v10.94,14.54 | v26.4,14 26.21,14.2 22.6,14.2 22.18,14.62 IC1.60
  Bottom 0.2: v26.4,14 26.12,14 25.42,14.7 21.83,14.7 21.67,14.54 v10.94,14.54
D13  (via drill 0.3 pad 0.45)
  Top 0.2: IC2.36 13.16,14.8 13.07,14.89 11.6,14.89 10.83,15.66 v9.6,15.66 | v26.14,14.76 25.94,14.56 22.74,14.56 22.33,14.97 21.43,14.97 21.28,15.12 IC1.59
  Bottom 0.2: v9.6,15.66 9.8,15.46 11.84,15.46 12.05,15.25 12.3,15.25 arc90 12.59,15.54 arc-90 12.88,15.83 12.88,15.83 arc-90 13.18,15.54 arc90 13.47,15.25 13.47,15.25 arc90 13.76,15.54 arc-90 14.05,15.83 14.05,15.83 arc-90 14.34,15.54 arc90 14.63,15.25 14.64,15.25 arc90 14.93,15.54 arc-90 15.22,15.83 15.22,15.83 arc-90 15.51,15.54 arc90 15.8,15.25 21.38,15.25 21.54,15.4 22.12,15.4 | 22.12,15.4 | v26.14,14.76 26.08,14.76 25.03,15.81 24.57,15.81 24.16,15.4 22.12,15.4
D14  (via drill 0.3 pad 0.45)
  Top 0.2: IC2.37 11.39,15.6 10.98,16.01 10.71,16.01 v9.6,17.12 | IC1.53 21.18,18.12 22.45,16.85 22.95,16.85 22.97,16.87 23.53,16.87 23.8,16.6 24.2,16.6 24.99,15.81 25.81,15.81 v25.91,15.71
  Bottom 0.2: v9.6,17.12 15.92,17.12 16.72,16.32 19,16.32 arc90 19.29,16.61 19.29,16.77 arc-90 19.58,17.05 20.14,17.05 arc-90 20.43,16.77 20.43,16.61 arc90 20.72,16.32 20.96,16.32 21.51,16.87 23.81,16.87 24.52,16.16 25.18,16.16 25.63,15.71 v25.91,15.71
D15  (via drill 0.3 pad 0.45)
  Top 0.2: IC2.38 11.8,16.4 10.51,17.69 v9.04,17.69 | IC1.52 20.14,18.52 21.27,18.52 22.59,17.2 22.81,17.2 22.82,17.22 24.08,17.22 24.58,16.72 v24.87,16.72
  Bottom 0.2: v9.04,17.69 9.06,17.68 9.83,17.68 10.03,17.47 12.21,17.47 arc90 12.51,17.77 arc-90 12.8,18.05 12.82,18.05 arc-90 13.11,17.77 arc90 13.4,17.47 13.42,17.47 arc90 13.71,17.77 arc-90 14,18.05 14.02,18.05 arc-90 14.31,17.77 arc90 14.6,17.47 14.62,17.47 arc90 14.91,17.77 arc-90 15.2,18.05 15.22,18.05 arc-90 15.51,17.77 arc90 15.8,17.47 15.82,17.47 arc90 16.11,17.77 arc-90 16.4,18.05 16.42,18.05 arc-90 16.71,17.77 arc90 17,17.47 17.09,17.47 17.37,17.75 18.38,17.75 18.66,17.47 23.7,17.47 24.46,16.72 v24.87,16.72
GND  (via drill 0.3, 0.3 pad 0.45, 0.35, 0.4, 0.5, 0.5 pad 0.45, 2)
  Top 0.2: IC1.98 32.84,6.56 v32.8,6.6 | IC1.5 34.52,9.12 v34.2,8.4 | IC1.17 34.52,15.12 v34.4,15 | v27.8,18.8 27.34,19.26 IC1.39 27.34,23.26 27.2,23.4 | C5.2 | IC2.39 IC2.40 11.18,18 v10.8,18.38 | IC1.32 30.84,22.35 31.26,22.77 31.26,24.46 | IC1.23 34.08,18.12 v34,18.2
  Top 0.25: IC4.P$6 42.65,24.05 v42.4,23.8 | IC4.P$8 43.04,23.05 42.81,22.82 41.67,22.82 v41.66,22.8 | IC4.P32 53.77,24.55 v54.41,25.19
  Top 0.254: R12.1 R14.2 | IC4.P41 49.15,28.95 v49,29.4
  Top 0.3: v26.8,6.47 26.65,6.32 26.07,6.32 25.84,6.1 IC1.84 | IC1.47 23.34,22.41 C14.2 | C11.2 C1.2 C10.2 | C9.2 C18.2 | v19.2,26 19.1,25.9 19.38,25.9 19.09,25.79 18.7,27.41 17.71,28.2 | C35.2 53.35,33.15 54.4,34.2 56.19,34.2 56.21,34.19 57,33.4 | IC1.17 37.12,15.12 37.2,15.2 | C20.2 33.4,27.85 J1.5 33.4,30.2 33.6,30.4
  Top 0.305: IC1.70 18.53,9.62 C13.2 17.55,9.75 v17.4,9.6 | IC1.55 18.67,17.12 C12.2 | C3.2 C16.2 18.74,3.55 v17,5.29
  Top 0.4: v6.34,13.6 5.14,12.4 IC2.12 1.65,12.4 C27.2 | v9.05,13.74 13.08,13.74 13.62,13.2 IC2.34 15.8,13.2 C26.2 15.8,13.3 v15.8,13.99 | C2.2 17.45,13.49 v17.45,13.92 | C12.2 18.27,16.92 v17.45,16.92 17.45,18.86 v18.8,20.2 | v33.66,1.94 33.49,2.11 31.96,2.11 31.72,2.35 C6.2 C5.2 | IC3.4 7.5,23.3 v7.6,23.4 | C10.2 34.14,23.86 | v9.8,7.2 v7.4,9.6 | C19.2 15.55,25.75 v16.8,25.8 | 15.4,24.2 v13.2,22
  Top 0.406: 39.05,25.05 v38.4,24.2 38.45,24.15 | v38.1,31.3 38.15,30.05 NTC1.1
  Bottom 0.25: v54.41,25.19 v54.4,25.2
  Bottom 0.305: 17,5.2 v17,5.29
  Bottom 0.4: v6.34,13.6 8.91,13.6 v9.05,13.74 | v17,5.29 17,6.25 v16.86,6.4
  other vias: 30.2,17.2 44,28.4 59.2,5.8 44.1,13.9 16,9.6 20.2,23.8 38.4,28.2 11,21.4 2.8,31.8 17.8,28.2 19.8,20.2 10.6,20 7.6,20 9,21.4 28.4,13.2 27.4,14.4 32,13.8 30.8,11.4 30.8,13.2 28,25 57.2,3 58.4,31.8 41.7,32.9 37.8,27.4 37,22 30.2,15.2 39,18.8 42,18.8 59.2,8.2 59.2,10.4 59.2,12.4 59.2,15.2 59.2,16.6 59.2,19.2 59.2,22 59.2,23.8 37.8,20.6 37.2,28.4 37.2,30 5.34,12 5.14,17.2 1.54,6.8 1.54,5.4 0.74,3.8 1.34,2.2 2.94,1 4.94,0.8 7.54,0.8 11.34,5.8 4.54,9.6 28.6,18 28.6,16.2 27.4,17.4 19.2,23.8 19.2,31.8 37.2,10.6 40.2,16.4 41.4,16 43.8,12.8 7.8,26.6 13.4,31 11.2,31 11.2,33.2 8.6,33.2 13.8,33.2 17.6,20.2 11,28.4 53.2,14.14 56.86,14.2 55.66,14.2 54.46,14.2 58.06,14.2 46.26,9.4 46.26,10.6 52,14.14 50.8,14.14 32.5,9.25 31,7.2 35.1,2.4 37,2.4 39.4,2.4 42.6,2.4 42.2,5.2 39.8,7.6 44.8,0.6 42.2,0.6 39.6,0.6 37,0.6 34.4,0.6 47.2,0.6 49.8,0.6 52.4,0.6 53.6,4.4 45.35,5 45.3,8.5 33,32.6 21.8,30.8 19.2,33.4 21.8,33.4 27.2,28 18.2,30 26.18,24.34
  pour Bottom (isolate 0.2, rank 6, no thermals): -1.2,36.4 61,36.4 61,-1.2 -1.2,-1.2
  pour Top (isolate 0.3, no thermals): -0.6,35 60.2,35.2 60.2,-0.8 -0.6,-1
INT_LDO1
  Top 0.25: IC4.P$7 42.97,23.55 42.64,23.22 42.16,23.22 41.98,23.4 C39.1
INT_PIN  (via drill 0.3)
  Top 0.2: v36.05,22.05 36.91,22.91 v36.91,24.89
  Top 0.25: IC4.P$2 42.72,26.05 v42.54,26.23
  Bottom 0.2: v42.54,26.23 37.84,26.23 37.77,26.16 37.17,26.16 36.84,25.83 36.84,25.37 36.91,25.31 v36.91,24.89 | 37.11,20.27 37.11,20.2 | 37.11,20.2 37.11,19.22 38.76,17.58 44.12,17.58 | 37.11,20.2 37.11,21 v36.05,22.05
  Bottom 0.3: J2.8 44.69,13.56 44.76,13.63 44.76,16.95 44.12,17.58
LCD_CKV
  Top 0.2: J1.32 19.9,27.9 20.04,27.76 20.04,25.47 | IC1.42 25.84,21.99 25.25,22.58 25.22,22.58 23.6,24.2 21.21,24.2 20.25,25.17 20.25,25.27 20.04,25.47 | 20.04,25.47 20.04,25.4
LCD_CL  (via drill 0.3)
  Top 0.2: IC1.21 34.32,17.12 v34.2,17 | v32.8,30.4 32.35,29.95 32.17,29.95 31.9,29.68 J1.8
  Bottom 0.2: v34.2,17 34.4,17 35,17.6 35,21.17 34.67,21.5 34.67,28.52 v32.8,30.4
LCD_D0  (via drill 0.3)
  Top 0.2: J1.13 29.4,30 v30.8,31.4 | IC1.27 33.34,19.94 33.2,19.8 33.2,16.55 v32.83,16.17
  Bottom 0.2: v30.8,31.4 30.8,31.2 30.4,30.8 30.4,28.5 32.51,26.39 32.51,16.49 v32.83,16.17
LCD_D1  (via drill 0.3)
  Top 0.2: IC1.28 32.84,16.97 v32.03,16.16 | v30,31.4 29.8,31.4 28.9,30.5 J1.14
  Bottom 0.2: v32.03,16.16 32.03,16.45 32.16,16.57 32.16,17.45 31.91,17.69 31.91,26.49 30,28.4 v30,31.4
LCD_D2  (via drill 0.3)
  Top 0.2: IC1.29 32.34,17.54 v31.6,16.8 | v29.4,32 28.4,31 J1.15
  Bottom 0.2: v29.4,32 29.4,28.4 31.55,26.24 31.55,16.84 v31.6,16.8
LCD_D3  (via drill 0.3)
  Top 0.2: IC1.30 31.84,18.84 v31,18 | v27.8,31.8 27.9,31.7 J1.16
  Bottom 0.2: 30.75,24.57 30.75,24.47 | 30.75,24.57 30.75,26.55 27.8,29.5 v27.8,31.8 | 30.75,24.57 30.75,19.11 30.95,18.91 30.95,18.05 v31,18
LCD_D4  (via drill 0.3)
  Top 0.2: J1.17 27.4,30.87 v27.04,31.23 | IC1.33 30.34,18.73 v30.39,18.68
  Bottom 0.2: v27.04,31.23 27.2,31.07 27.2,29.6 30.39,26.41 v30.39,18.68
LCD_D5  (via drill 0.3)
  Top 0.2: J1.18 26.9,30.3 v26.4,30.8 | IC1.34 29.84,18.16 v30,18
  Bottom 0.2: v26.4,30.8 26.4,29.8 29.6,26.6 29.6,18.4 v30,18
LCD_D6  (via drill 0.3)
  Top 0.2: IC1.36 28.84,19.24 v28.6,19 | v27.09,25.6 27.09,25.8 26.4,26.5 J1.19
  Bottom 0.2: 27,25.5 v27.09,25.6 27.45,25.25 27.45,23.37 28.6,22.21 v28.6,19
LCD_D7  (via drill 0.3)
  Top 0.2: IC1.37 28.34,20.05 v27.89,19.6 | v26.29,25.29 26.29,25.71 25.9,26.1 J1.20
  Bottom 0.2: v27.89,19.6 27.89,22.42 27.09,23.22 27.09,24.49 v26.29,25.29
LCD_GMODE  (via drill 0.3)
  Top 0.2: J1.28 J1.29 21.5,29.05 21.5,25.5 v21.59,25.4 | IC1.40 26.84,22.56 v25.8,23.6
  Bottom 0.2: v25.8,23.6 24,25.4 v21.59,25.4
LCD_GVDD  (via drill 0.3)
  Top 0.2: J1.24 23.9,28.25 C25.1
  Top 0.25: R15.2 57.95,30.05 v58,30
  Top 0.3: R13.1 R15.2 | D11.C 54.76,33 v55.35,33.59 | J1.24 23.9,32.1 v23.8,32.2
  Bottom 0.3: v58,30 55.35,32.65 v55.35,33.59 55.2,33.74 25.34,33.74 v23.8,32.2
LCD_GVEE  (via drill 0.3)
  Top 0.2: J1.26 22.9,27.65 C29.1
  Top 0.25: R20.2 57.2,19.65 D13.A 58.2,21.8 v58.2,23.8
  Top 0.3: R11.2 v58.2,23.8 | J1.26 22.9,32.1 v22.8,32.2
  Bottom 0.3: v58.2,23.8 59.6,25.2 59.6,30.44 59.59,30.44 59.6,30.6 59.6,30.61 59.55,31.21 59.4,31.8 59.16,32.36 59.06,32.51 58.1,33.51 57.85,33.7 | 57.85,33.7 | 57.85,33.7 57.53,33.86 | 57.53,33.86 | 57.53,33.86 57.37,33.94 57.14,34.01 | 57.14,34.01 | 57.14,34.01 56.96,34.07 56.93,34.07 56.92,34.08 56.79,34.12 56.57,34.15 56.05,34.15 56,34.2 24.8,34.2 v22.8,32.2
LCD_LE  (via drill 0.3)
  Top 0.2: IC1.24 36.62,18.62 37,19 37,19.29 36.55,19.75 36.05,19.75 v35.6,20.2 | J1.9 31.4,29.73 31.9,30.23 31.9,30.3 v32.79,31.19
  Bottom 0.2: v35.6,20.2 35.6,21.07 35.02,21.64 35.02,28.96 v32.79,31.19
LCD_OE  (via drill 0.3)
  Top 0.2: v31.6,31.2 31.55,31.15 31.55,30.38 30.9,29.73 J1.10 | IC1.25 33.88,19.12 v33.8,19.2
  Bottom 0.2: v31.6,31.2 31.6,28.3 33.62,26.28 33.62,19.38 v33.8,19.2
LCD_SPH  (via drill 0.3)
  Top 0.2: v33.06,22.2 33.38,21.87 33.59,21.87 33.84,21.63 IC1.26 | J1.12 29.9,29.7 30.6,30.4 30.79,30.4 v30.99,30.61
  Bottom 0.2: v33.06,22.2 33.06,24.35 33.05,24.37 33.05,26.36 31,28.4 v31,30.6 v30.99,30.61
LCD_SPV  (via drill 0.3)
  Top 0.2: J1.31 20.4,27.9 20.8,27.5 v20.8,25.4 | IC1.41 26.34,22.27 v25.81,22.81
  Bottom 0.2: v25.81,22.81 25.25,23.37 25.25,23.55 24,24.8 21.4,24.8 v20.8,25.4
LCD_VCOM  (via drill 0.3)
  Top 0.2: R17.2 43.35,15.9 43.35,16 42.6,16.76 C47.1
  Top 0.25: R17.2 44.77,16.22 44.77,17.97 45,18.2 45.42,18.2 46.65,19.43 IC4.P15 | v41.4,17 42.55,17 C47.1
  Top 0.3: J1.22 24.9,32.1 v24.8,32.2
  Bottom 0.25: v41.4,17 41.2,17.2 38.6,17.2 36.73,19.07 36.73,20.47 35.4,21.8 35.4,29.4 33,31.8 32.2,31.8 30.71,33.29
  Bottom 0.3: 30.71,33.29 25.89,33.29 v24.8,32.2
LCD_VNEG  (via drill 0.3)
  Top 0.2: C43.1 39.75,26.2 39.75,22.8 38.95,21.99 R16.2
  Top 0.25: IC4.P$3 42.4,25.55 C43.1
  Top 0.3: v42,27.2 C43.1 | v35.4,31.8 J1.1
  Bottom 0.3: 39.45,32.15 39.5,32.1 | 39.5,32.1 42,29.6 v42,27.2 | 39.5,32.1 35.7,32.1 v35.4,31.8
LCD_VPOS  (via drill 0.3)
  Top 0.2: 49.2,18.09 49.2,16.15 R18.2 | J1.3 34.4,27.65 C28.1
  Top 0.25: IC4.P44 47.65,28.35 v47.6,28.4 45.8,30.2 44.25,30.2 C48.2 | v49.2,18.8 49.2,18.09
  Top 0.3: v43.2,30.2 C48.2 | v34.4,31.8 J1.3
  Bottom 0.25: v47.6,28.4 45.2,28.4 44.4,27.6 44.4,26.6
  Bottom 0.254: 44.4,26.6 44.4,20 44.8,19.6 48.4,19.6 v49.2,18.8
  Bottom 0.3: v43.2,30.2 40.62,32.78 35.38,32.78 v34.4,31.8
N$1
  Top 0.4: IC3.7 9.63,25.84 8.38,24.57 IC3.3 5.88,24.6 5,24.6 3.8,23.4 R1.1
N$2
  Top 0.4: IC3.1 3.75,27.11 R3.1 3.25,25.2 R2.2
N$3
  Top 0.25: LED1.C R7.2
N$4
  Top 0.25: R8.2 53.58,8.2 54.78,9.4
  Top 0.3: 54.78,9.4 R9.2
  Top 0.6: C17.1 R8.2 | R9.2 54.85,10.51 55.5,11.16 IC5.5
N$5
  Top 0.6: IC5.3 57.15,13.15 56.6,12.6 56.6,9.9 L1.P$1
N$6
  Top 0.25: 47.39,8.21 47.47,8.22 | 47.39,8.21 R10.2 | R21.2 48.59,9.4 47.39,8.21
  Top 0.3: 48.58,9.4 R21.2
  Top 0.6: IC6.5 48.65,10.4 R21.2 | R10.2 C23.1
N$7
  Top 0.6: IC6.3 50.75,12.95 50.4,12.6 50.4,9.4 L2.P$1
N$8
  Top 0.25: R22.2 44.7,10.15 LED2.A
N$41
  Top 0.25: IC4.P40 49.65,28.05 49.9,28.3
  Top 0.3: L3.P$2 49.3,31.1 50,30.4 D8.A 50,28.4 49.9,28.3 49.8,28.2
N$42
  Top 0.3: IC4.P25 52.15,21.05 52.6,20.6 52.6,19.2 53,18.8 54,18.8 55,17.8 55.9,17.8 L4.P$1 58.3,17.7 D9.C
N$43
  Top 0.3: IC4.P$1 44.25,26.55 41.6,29.2 C44.1
N$44
  Top 0.25: IC4.P30 52.65,23.55 53,23.2 54.1,23.2 C50.1
  Top 0.3: C50.1 54.55,23.05 54.8,22.8 56.5,22.8 D12.C
N$45  (via drill 0.3)
  Top 0.25: IC4.P34 53.37,25.55 v54.31,26.49 | v58.07,27.47 58.07,27.65 58.58,28.16 | 58.58,28.16 | 56.15,31.4 D10.A 57.05,31.4 C49.2 57.45,31.55 58.6,30.4 58.6,28.18 58.58,28.16
  Bottom 0.25: v54.31,26.49 57.09,26.49 v58.07,27.47
N$46
  Top 0.25: C46.1 54.26,30.06 54.6,30.4 54.6,31.2 D11.A 54.65,31.6 D10.C
N$47
  Top 0.2: 54.21,23.74 55.49,23.74 R11.1
  Top 0.22: 54.21,23.74 53.09,23.74 52.78,24.05 IC4.P31 | R11.1 R12.2
N$48
  Top 0.25: R13.2 55.55,28.3 R14.1 54.98,26.03 54.94,26.03 54.71,25.8 54.2,25.8 53.45,25.05 IC4.P33
  Top 0.3: R14.1 55.6,26.75
N$49
  Top 0.25: IC4.P36 52.15,26.55 52.6,27 52.6,27.6 C46.2
N$50
  Top 0.25: C45.2 54.8,20.8 55.58,20.8 55.6,20.82
  Top 0.3: 55.45,21.95 D12.A 55.6,20.82 D13.C
N$51
  Top 0.25: IC4.P28 52.45,22.55 53.2,21.8 53.2,21.3 C45.1
N$52  (via drill 0.3)
  Top 0.25: IC4.P35 53.05,26.05 54.4,27.4 v54.6,27.4 | v58,28.4 57.05,28.4 R15.1
  Bottom 0.25: v54.6,27.4 57,27.4 v58,28.4
N$53
  Top 0.25: IC4.P14 46.15,19.75 45.8,19.4 45.4,19.4 44,18 44,17.15 R17.1
N$54
  Top 0.25: 48.54,19.07 48.54,17.31 R18.1
  Top 0.254: IC4.P19 48.65,19.18 48.54,19.07
N$55
  Top 0.3: 40.64,30.64 40.68,30.6 41.6,30.6 43.15,29.05 44.27,29.05 45.13,28.2 45.8,28.2 46.15,27.85 IC4.P47
  Top 0.406: NTC1.2 40.64,30.64 R19.2
N$56  (via drill 0.3)
  Top 0.25: v54.51,19.6 R20.1 | IC4.P29 52.55,23.05 53.4,22.2 53.8,22.2 v54,22
  Bottom 0.25: v54,22 54,20.11 v54.51,19.6
PG_PIN  (via drill 0.3)
  Top 0.2: v49.83,13.97 49.55,13.97 49.08,13.49 46.9,13.49 45.2,11.8 LED2.C
  Top 0.25: IC4.P23 50.65,19.3 v50.55,19.2
  Bottom 0.25: v49.83,13.97 50.12,14.25 50.12,14.42 50.55,14.84 v50.55,19.2
SCL_PIN  (via drill 0.3)
  Top 0.2: IC4.P17 47.65,18.43 v47.11,17.89
  Top 0.25: v48.6,3.46 48.6,1.43 J2.11
  Bottom 0.25: v47.11,17.89 49.05,15.95 49.05,14.57 48.12,13.64 48.12,4.95 48.6,4.47 v48.6,3.46
SDA_PIN  (via drill 0.3)
  Top 0.2: IC4.P18 48.15,18.09 v47.96,17.9
  Bottom 0.25: v47.96,17.9 48.5,17.9 49.45,16.95 49.45,14.41 48.52,13.47 48.52,5.12 J2.12
SPI_CLK
  Top 0.3: 36.28,7.12 IC1.1 36.48,7.12 36.8,6.8 36.8,5.4 36,4.6 36,1.53 J2.1
SPI_CMD  (via drill 0.3)
  Top 0.3: IC1.8 33.73,10.62 v33.67,10.67
  Bottom 0.3: v33.67,10.67 33.89,10.67 38.58,5.98 39.62,5.98 41.19,4.41 41.19,2.95 42.67,1.48 42.67,1.33 J2.7
SPI_CS  (via drill 0.3)
  Top 0.3: IC1.9 34.68,11.12 34.3,11.5 34.29,11.49 v33.49,11.49
  Bottom 0.3: v33.49,11.49 33.71,11.49 33.92,11.28 | J2.6 41.65,4.37 41.65,4.59 39.81,6.43 38.77,6.43 33.92,11.28 | 33.92,11.28
SPI_DATA0
  Top 0.3: IC1.2 36.62,7.62 37.25,6.99 37.25,4.05 J2.2
SPI_DATA1
  Top 0.3: 36.56,8.12 IC1.3 36.88,8.12 38.2,6.8 38.2,1.47 J2.3
SPI_DATA2
  Top 0.3: J2.4 39,4.48 39,6.8 37.18,8.62 IC1.4
SPI_DATA3  (via drill 0.3)
  Top 0.3: IC1.7 33.98,10.12 33.92,10.07 33.55,10.07 v33.4,9.91
  Bottom 0.3: v33.4,9.91 34.01,9.91 38.77,5.15 39.81,5.15 40.74,4.22 40.74,1.47 J2.5 40.8,1.41
VB  (via drill 0.3)
  Top 0.25: IC4.P37 51.15,27.95 51.6,28.4
  Top 0.254: IC4.P42 48.4,27.27 IC4.P43
  Top 0.3: 51.6,28.4 D8.C v52.6,29.4 53.2,30 C35.1 | 48.4,27.27 48.4,27.28 48.4,28.8 47.8,29.4 v47.6,29.4 45.75,31.25 C36.1
  Bottom 0.3: v52.6,29.4 50.6,29.4 50,30 49.33,30 49.27,30.05 48.26,30.05 v47.6,29.4
VIN  (via drill 0.35, 0.5)
  Top 0.2: IC5.4 55.6,13.05 | IC6.4 49.2,12.7
  Top 0.25: IC5.1 58.98,11.25 v59,11.23 | IC6.1 52.55,10.95 v52.6,11
  Top 0.6: 49.2,12.7 v49.2,12 | IC6.4 48,12.85 C24.1 | IC5.4 54.1,13.15 C21.1
  Top 0.8: 55.6,13.05 v55.6,12.2
  Bottom 0.25: v59,11.23 56.57,11.23 v55.6,12.2 | v52.6,11 51.08,11 51,10.92
  Bottom 0.8: 51.02,12 v49.2,12 | 51.02,12 55.4,12 v55.6,12.2 | 51.02,12 51,11.98 51,10.92 51,10.4 52.31,9.09 J2.14
VN  (via drill 0.3)
  Top 0.2: IC4.GN10 IC4.GN0
  Top 0.25: C42.1 40.75,25.1 40.8,25.05 | C37.1 46.53,17.68 46.53,18.13 47.15,18.75 IC4.P16
  Top 0.254: IC4.GN13 46.65,25.05 IC4.P$4 40.8,25.05 | IC4.P16 47.15,22.05 IC4.GN16 | IC4.P22 50.15,22.05 | 50.15,22.05 IC4.P27 IC4.P26 | 50.15,22.05 IC4.GN4
  Top 0.3: v52,19 v51.99,19 51.99,18.55 C41.1 53.95,16.6 57.8,16.6 58.2,16.2 D9.A
  Bottom 0.3: v51.99,19 51.99,20 52,20
  pour Bottom (isolate 0.25, no thermals): 52.4,27.8 52.4,19.8 44.4,19.8 44.4,27.8
VNEG_DIS1
  Top 0.25: IC4.P$9 43.11,22.55 42.78,22.22 41.07,22.22 R16.1
WAKE_PIN  (via drill 0.3)
  Top 0.25: IC4.P$5 42.08,24.55 v42,24.47
  Top 0.3: J2.9 45.96,3.56 v46,3.6
  Bottom 0.2: v42,24.47 41.67,24.47 40.8,23.6 40.8,21.4
  Bottom 0.3: 40.8,21.4 44.17,18.03 44.31,18.03 45.21,17.13 45.21,9.46 46,8.67 v46,3.6

## Text on the board
tDocu: 1 | VD_RD | UNDA Technologies